# EAGLE design Capstone (EAGLE 9.5.2)
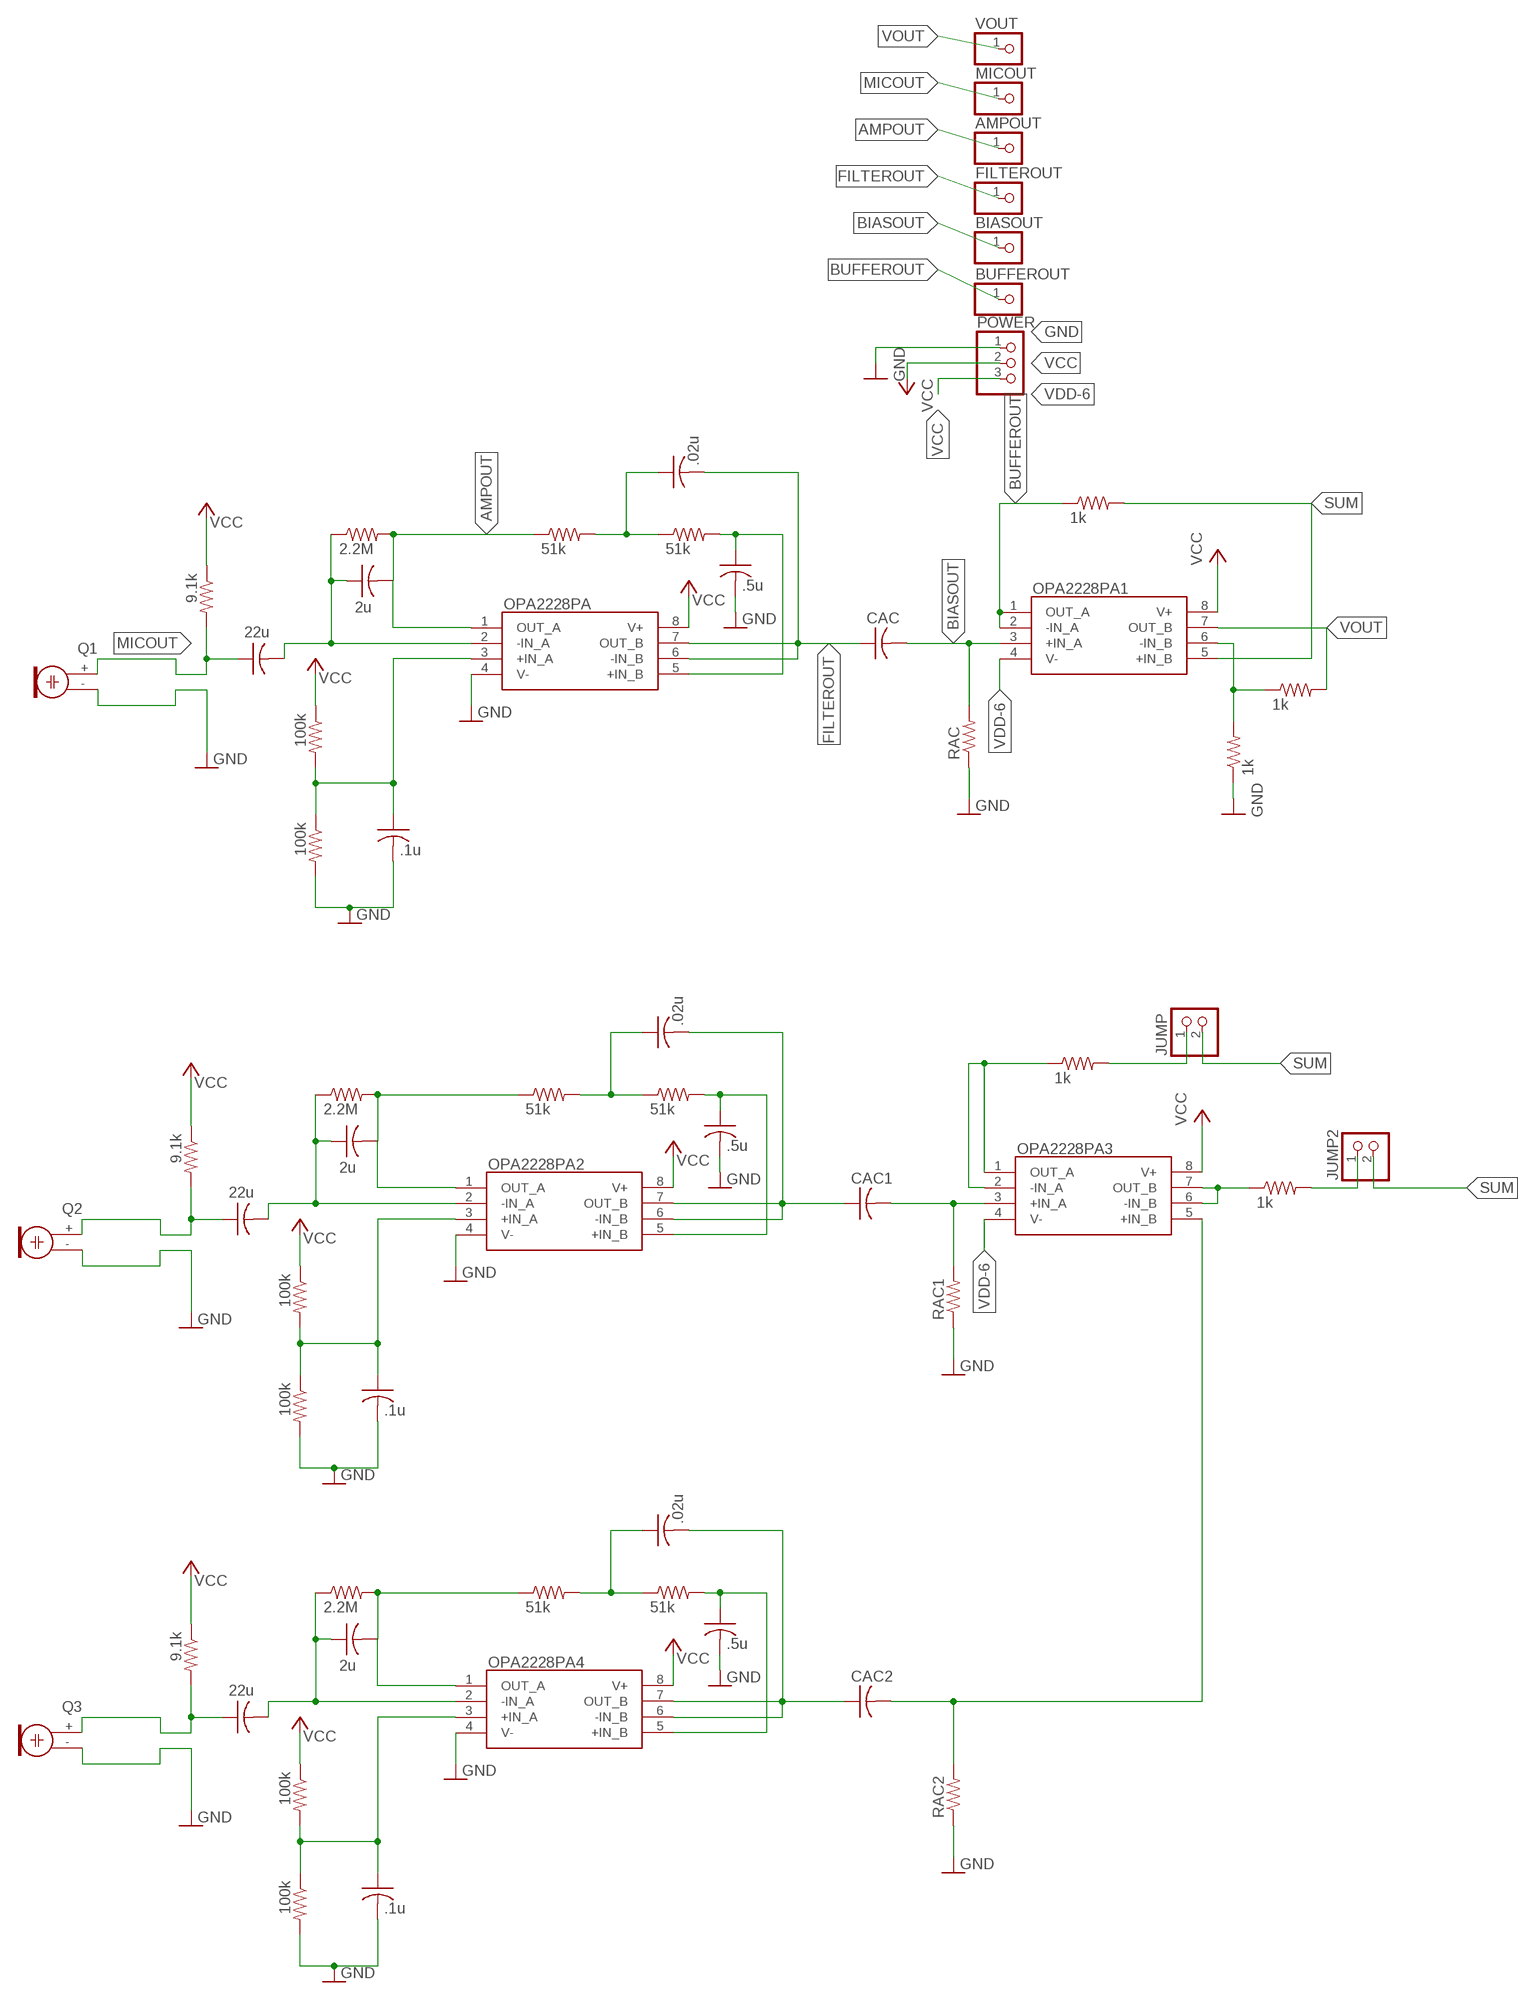
[diagram p0: schematic, sheet 1]

## Parts
AMPOUT  PINHD-1X1  [1X01]
BIASOUT  PINHD-1X1  [1X01]
BUFFEROUT  PINHD-1X1  [1X01]
C1  .1u  C-US025-024X044  [C025-024X044]
C2  2u  C-US025-024X044  [C025-024X044]
C3  22u  C-US025-024X044  [C025-024X044]
C4  .02u  C-US025-024X044  [C025-024X044]
C5  .5u  C-US025-024X044  [C025-024X044]
C6  .1u  C-US025-024X044  [C025-024X044]
C7  2u  C-US025-024X044  [C025-024X044]
C8  22u  C-US025-024X044  [C025-024X044]
C9  .02u  C-US025-024X044  [C025-024X044]
C10  .5u  C-US025-024X044  [C025-024X044]
C11  .1u  C-US025-024X044  [C025-024X044]
C12  2u  C-US025-024X044  [C025-024X044]
C13  22u  C-US025-024X044  [C025-024X044]
C14  .02u  C-US025-024X044  [C025-024X044]
C15  .5u  C-US025-024X044  [C025-024X044]
CAC  C-US025-024X044  [C025-024X044]
CAC1  C-US025-024X044  [C025-024X044]
CAC2  C-US025-024X044  [C025-024X044]
FILTEROUT  PINHD-1X1  [1X01]
JUMP  PINHD-1X2  [1X02]
JUMP2  PINHD-1X2  [1X02]
MICOUT  PINHD-1X1  [1X01]
OPA2228PA  OPA2228PA  [DIP794W53P254L959H508Q8N]
OPA2228PA1  OPA2228PA  [DIP794W53P254L959H508Q8N]
OPA2228PA2  OPA2228PA  [DIP794W53P254L959H508Q8N]
OPA2228PA3  OPA2228PA  [DIP794W53P254L959H508Q8N]
OPA2228PA4  OPA2228PA  [DIP794W53P254L959H508Q8N]
POWER  PINHD-1X3  [1X03]
Q1  ELECTRET  [9.7ELECTRET]
Q2  ELECTRET  [9.7ELECTRET]
Q3  ELECTRET  [9.7ELECTRET]
R1  9.1k  R-US_0204/7  [0204/7]
R2  100k  R-US_0204/7  [0204/7]
R3  100k  R-US_0204/7  [0204/7]
R4  2.2M  R-US_0204/7  [0204/7]
R5  51k  R-US_0204/7  [0204/7]
R6  51k  R-US_0204/7  [0204/7]
R7  1k  R-US_0204/7  [0204/7]
R8  1k  R-US_0204/7  [0204/7]
R9  1k  R-US_0204/7  [0204/7]
R10  9.1k  R-US_0204/7  [0204/7]
R11  100k  R-US_0204/7  [0204/7]
R12  100k  R-US_0204/7  [0204/7]
R13  2.2M  R-US_0204/7  [0204/7]
R14  51k  R-US_0204/7  [0204/7]
R15  51k  R-US_0204/7  [0204/7]
R16  1k  R-US_0204/7  [0204/7]
R17  9.1k  R-US_0204/7  [0204/7]
R18  100k  R-US_0204/7  [0204/7]
R19  100k  R-US_0204/7  [0204/7]
R20  2.2M  R-US_0204/7  [0204/7]
R21  51k  R-US_0204/7  [0204/7]
R22  51k  R-US_0204/7  [0204/7]
R23  1k  R-US_0204/7  [0204/7]
RAC  R-US_0204/7  [0204/7]
RAC1  R-US_0204/7  [0204/7]
RAC2  R-US_0204/7  [0204/7]
VOUT  PINHD-1X1  [1X01]

## Nets
1: C8.1 Q2.+ R10.2
2: C13.1 Q3.+ R17.2
AMPOUT: AMPOUT.1 C2.2 OPA2228PA.1(OUT_A) R4.2 R5.1
AMPOUT1: C7.2 OPA2228PA2.1(OUT_A) R13.2 R14.1
AMPOUT2: C12.2 OPA2228PA4.1(OUT_A) R20.2 R21.1
BIASOUT: BIASOUT.1 CAC.2 OPA2228PA1.3(+IN_A) RAC.2
BIASOUT1: CAC1.2 OPA2228PA3.3(+IN_A) RAC1.2
BIASOUT2: CAC2.2 OPA2228PA3.5(+IN_B) RAC2.2
BUFFEROUT: BUFFEROUT.1 OPA2228PA1.1(OUT_A) OPA2228PA1.2(-IN_A) R8.1
FILTEROUT: C4.2 CAC.1 FILTEROUT.1 OPA2228PA.6(-IN_B) OPA2228PA.7(OUT_B)
FILTEROUT1: C9.2 CAC1.1 OPA2228PA2.6(-IN_B) OPA2228PA2.7(OUT_B)
FILTEROUT2: C14.2 CAC2.1 OPA2228PA4.6(-IN_B) OPA2228PA4.7(OUT_B)
GND: C1.2 C5.2 C6.2 C10.2 C11.2 C15.2 OPA2228PA2.4(V-) OPA2228PA4.4(V-) OPA2228PA.4(V-) POWER.1 Q1.- Q2.- Q3.- R3.2 R7.1 R12.2 R19.2 RAC1.1 RAC2.1 RAC.1
MICOUT: C3.1 MICOUT.1 Q1.+ R1.2
N$1: C6.1 OPA2228PA2.3(+IN_A) R11.2 R12.1
N$3: C2.1 C3.2 OPA2228PA.2(-IN_A) R4.1
N$4: OPA2228PA1.6(-IN_B) R7.2 R9.1
N$5: C1.1 OPA2228PA.3(+IN_A) R2.2 R3.1
N$6: C7.1 C8.2 OPA2228PA2.2(-IN_A) R13.1
N$8: C4.1 R5.2 R6.1
N$9: C5.1 OPA2228PA.5(+IN_B) R6.2
N$10: C9.1 R14.2 R15.1
N$12: JUMP.1 R16.2
N$13: C10.1 OPA2228PA2.5(+IN_B) R15.2
N$14: OPA2228PA3.1(OUT_A) OPA2228PA3.2(-IN_A) R16.1
N$15: C11.1 OPA2228PA4.3(+IN_A) R18.2 R19.1
N$16: C12.1 C13.2 OPA2228PA4.2(-IN_A) R20.1
N$17: C14.1 R21.2 R22.1
N$18: C15.1 OPA2228PA4.5(+IN_B) R22.2
N$19: OPA2228PA3.6(-IN_B) OPA2228PA3.7(OUT_B) R23.1
N$20: JUMP2.1 R23.2
SUM: JUMP2.2 JUMP.2 OPA2228PA1.5(+IN_B) R8.2
VCC: OPA2228PA1.8(V+) OPA2228PA2.8(V+) OPA2228PA3.8(V+) OPA2228PA4.8(V+) OPA2228PA.8(V+) POWER.2 R1.1 R2.1 R10.1 R11.1 R17.1 R18.1
VDD-6: OPA2228PA1.4(V-) OPA2228PA3.4(V-) POWER.3
VOUT: OPA2228PA1.7(OUT_B) R9.2 VOUT.1

## Library data of the parts
AMPOUT BIASOUT BUFFEROUT FILTEROUT MICOUT VOUT = pinhead:PINHD-1X1: PIN HEADER
C1-C15 CAC CAC1 CAC2 = rcl:C-US: CAPACITOR, American symbol; SPICEPREFIX: C
JUMP JUMP2 = pinhead:PINHD-1X2: PIN HEADER
OPA2228PA OPA2228PA1-OPA2228PA4 = SamacSys_Parts:OPA2228PA: Dual, wide bandwidth, high precision, low noise operational amplifiers Source: Datasheet <http://componentsearchengine.com/Datasheets/3/OPA2228PA.pdf>; DESCRIPTION: Dual, wide bandwidth, high precision, low noise operational amplifiers; HEIGHT: 5.08mm; MANUFACTURER_NAME: Texas Instruments; MANUFACTURER_PART_NUMBER: OPA2228PA; MOUSER_PART_NUMBER: 595-OPA2228PA; MOUSER_PRICE-STOCK: https://www.mouser.com/Search/Refine.aspx?Keyword=595-OPA2228PA
POWER = pinhead:PINHD-1X3: PIN HEADER
Q1-Q3 = adafruit:ELECTRET: Electret microphone Thru hole 2.54mm spacing with 9.7mm diameter
R1-R23 RAC RAC1 RAC2 = rcl:R-US_: RESISTOR, American symbol; SPICEPREFIX: R

## Board
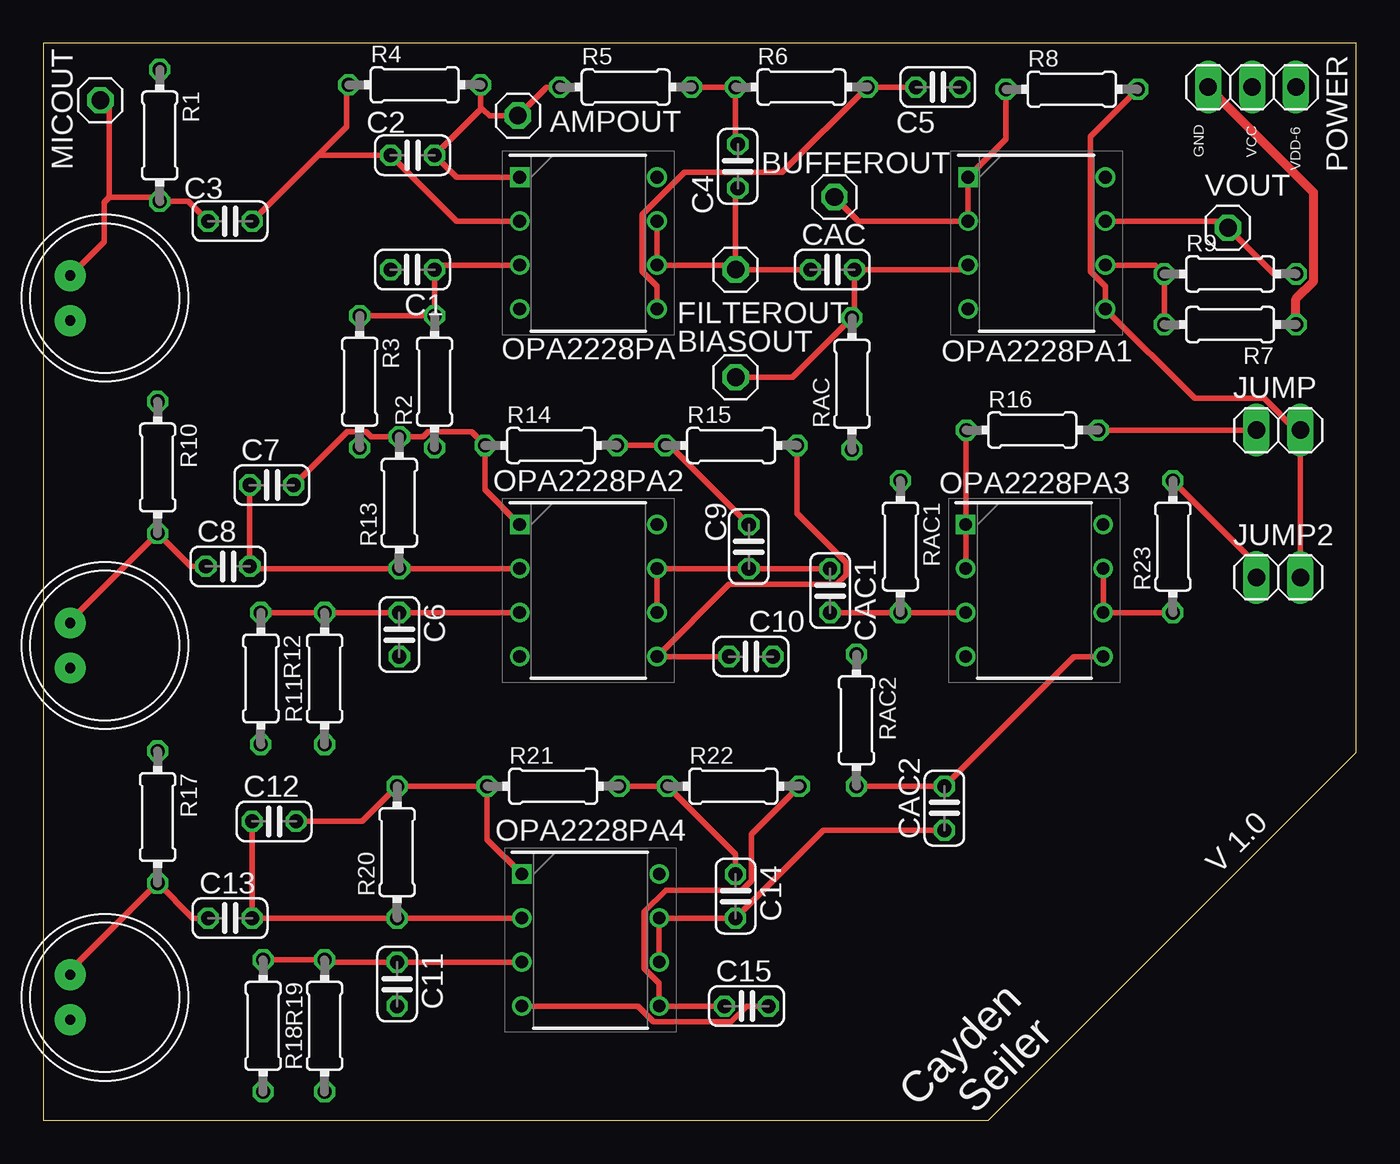
[diagram p1: board, top side]
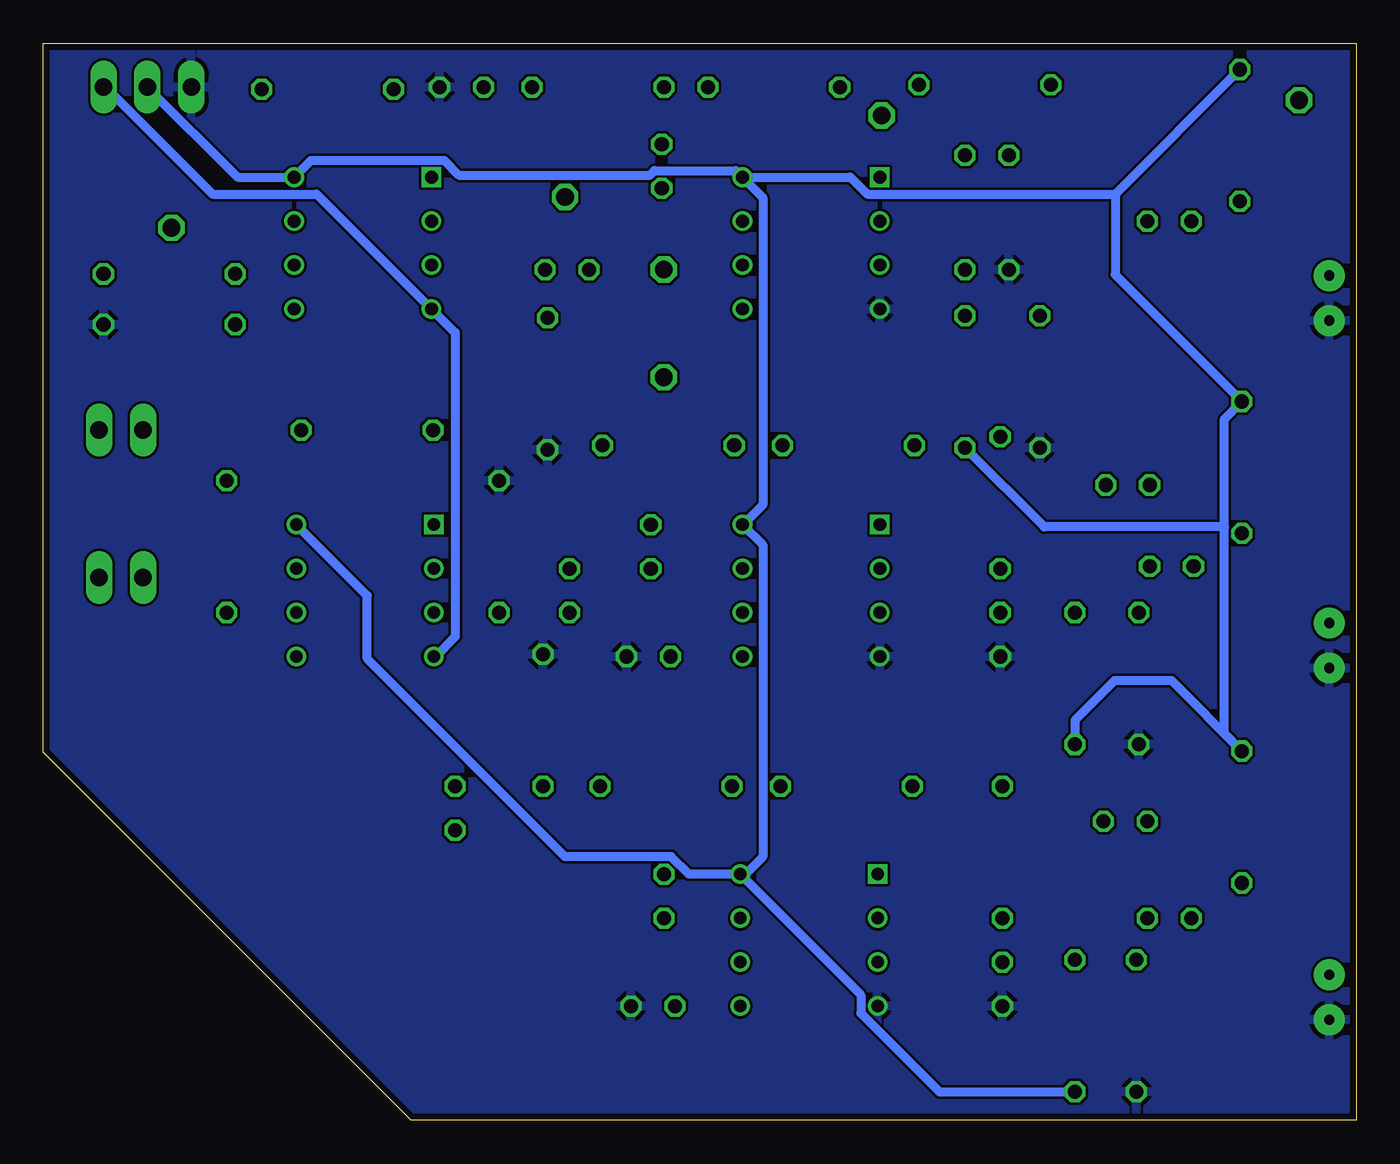
[diagram p2: board, bottom side, seen from below]

Size 75.87 x 62.22 mm. Coordinates in mm from the lower left corner, seen from the top.
Outline: 0,0 54.61,0 75.87,21.26 75.87,62.22 0,62.22 0,0
Copper layers (1*16): Top 0.035559375mm / dielectric 1.6mm / Bottom 0.035559375mm
Design rules "oshpark2layer": minimum track width 6mil, minimum drill 10mil, track to track 6mil, track to pad 6mil, pad to pad 6mil, via to via 6mil, smd to smd 6mil, copper to edge 15mil, drill to drill 6mil, minimum pad ring 5mil, minimum via ring 5mil, stop-mask expansion 2.5mil, vias tented up to drill 0mil, thermal gap 10mil

### Footprints (pad centres in the part's own frame; a part is rotated, then mirrored left to right if it is on the bottom)
1X01 = drill 1.016 octagon: 1 0,0
C025-024X044 = drill 0.813 octagon: 1 -1.27,0; 2 1.27,0
1X02 = drill 1.016 long: 1 -1.27,0; 2 1.27,0
DIP794W53P254L959H508Q8N = drill 0.73 pad 1.13 square: 1 -3.97,3.81 | drill 0.73 pad 1.13: 2 -3.97,1.27; 3 -3.97,-1.27; 4 -3.97,-3.81; 5 3.97,-3.81; 6 3.97,-1.27; 7 3.97,1.27; 8 3.97,3.81
1X03 = drill 1.016 long: 1 -2.54,0; 2 0,0; 3 2.54,0
9.7ELECTRET = drill 0.6 pad 1.778: + 1.3,2; - -1.3,2
0204/7 = drill 0.813 octagon: 1 -3.81,0; 2 3.81,0

### Placement (x,y rotation side)
AMPOUT  27.43,58.04 0 top
BIASOUT  40.01,42.93 0 top
BUFFEROUT  45.72,53.34 0 top
C1  21.34,49.15 180 top
C2  21.34,55.75 0 top
C3  10.79,51.94 0 top
C4  40.13,55.12 270 top
C5  51.69,59.69 0 top
C6  20.57,28.07 270 top
C7  13.21,36.7 0 top
C8  10.67,32 0 top
C9  40.77,33.15 270 top
C10  40.89,26.8 0 top
C11  20.45,7.87 270 top
C12  13.34,17.27 0 top
C13  10.79,11.68 0 top
C14  40.01,12.95 270 top
C15  40.64,6.6 0 top
CAC  45.59,49.15 0 top
CAC1  45.47,30.61 270 top
CAC2  52.07,18.03 90 top
FILTEROUT  40.01,49.15 0 top
JUMP  71.37,39.88 0 top
JUMP2  71.37,31.37 0 top
MICOUT  3.3,58.93 0 top
OPA2228PA  31.5,50.67 0 top
OPA2228PA1  57.4,50.67 0 top
OPA2228PA2  31.5,30.61 0 top
OPA2228PA3  57.28,30.61 0 top
OPA2228PA4  31.62,10.41 0 top
POWER  69.85,59.69 0 top
Q1  3.56,47.5 90 top
Q2  3.56,27.43 90 top
Q3  3.56,7.11 90 top
R1  6.73,56.9 270 top
R2  22.61,42.67 90 top
R3  18.29,42.67 270 top
R4  21.46,59.82 0 top
R5  33.66,59.69 0 top
R6  43.81,59.69 0 top
R7  68.58,45.97 180 top
R8  59.44,59.56 0 top
R9  68.58,48.89 0 top
R10  6.6,37.72 270 top
R11  16.26,25.53 90 top
R12  12.57,25.53 270 top
R13  20.57,35.69 90 top
R14  29.34,38.99 0 top
R15  39.75,38.99 0 top
R16  57.15,39.88 0 top
R17  6.6,17.53 270 top
R18  16.26,5.46 90 top
R19  12.7,5.46 270 top
R20  20.45,15.49 90 top
R21  29.46,19.3 0 top
R22  39.88,19.3 0 top
R23  65.28,33.15 90 top
RAC  46.74,42.55 90 top
RAC1  49.53,33.15 270 top
RAC2  46.99,23.11 270 top
VOUT  68.45,51.56 0 top

### Tracks (layer width: path | path; a pad name or v marks a point on that pad's centre or on a via)
1
  Top 0.305: C8.1 8.51,32 R10.2 1.56,28.86 Q2.+
2
  Top 0.305: C13.1 8.64,11.68 R17.2 1.56,8.67 Q3.+
AMPOUT
  Top 0.152: 25.27,58.42 25.4,58.42
  Top 0.305: OPA2228PA.1 23.88,54.48 C2.2 25.27,58.42 R4.2 | 25.4,58.42 25.78,58.04 AMPOUT.1 29.08,59.69 R5.1
AMPOUT1
  Top 0.305: C7.2 17.55,39.78 18.67,39.78 18.95,39.5 R13.2 21.95,39.5 22.23,39.78 24.74,39.78 R14.1 25.53,36.42 OPA2228PA2.1
AMPOUT2
  Top 0.305: OPA2228PA4.1 25.65,16.22 R21.1 R20.2 18.41,17.27 C12.2
BIASOUT
  Top 0.305: OPA2228PA1.3 53.18,49.15 CAC.2 46.86,46.48 RAC.2 43.31,42.93 BIASOUT.1
BIASOUT1
  Top 0.305: OPA2228PA3.3 RAC1.2 CAC1.2
BIASOUT2
  Top 0.305: OPA2228PA3.5 59.56,26.8 CAC2.2 RAC2.2
BUFFEROUT
  Top 0.305: BUFFEROUT.1 47.12,51.94 OPA2228PA1.2 OPA2228PA1.1 55.63,56.67 R8.1
FILTEROUT
  Top 0.305: OPA2228PA.7 OPA2228PA.6 39.75,49.4 FILTEROUT.1 | FILTEROUT.1 40.01,53.72 C4.2 | FILTEROUT.1 CAC.1
FILTEROUT1
  Top 0.305: OPA2228PA2.6 OPA2228PA2.7 C9.2 CAC1.1
FILTEROUT2
  Top 0.305: CAC2.1 45.09,16.76 C14.2 OPA2228PA4.7 OPA2228PA4.6
GND
  Top 0.305: C15.2 40.66,6.6 39.75,5.69 35.28,5.69 34.36,6.6 OPA2228PA4.4
  Top 0.508: R7.1 72.39,47.46 73.41,48.47 73.41,53.59 POWER.1
  pour Bottom: 76.2,62.23 0,62.23 0,0 54.61,0 76.2,21.59
MICOUT
  Top 0.152: 3.81,58.42 MICOUT.1
  Top 0.305: 3.81,53.34 3.81,58.42 | C3.1 8.38,53.09 R1.2 6.48,53.34 3.81,53.34 | 3.81,53.34 3.52,53.05 3.52,50.76 Q1.+
N$1
  Top 0.305: OPA2228PA2.3 C6.1 R11.2 R12.1
N$3
  Top 0.152: 17.65,59.69 R4.1
  Top 0.305: C3.2 15.88,55.75 | 15.88,55.75 17.53,57.4 17.53,59.56 17.65,59.69 | 15.88,55.75 C2.1 23.88,51.94 OPA2228PA.2
N$4
  Top 0.305: OPA2228PA1.6 64.26,49.4 R9.1 R7.2
N$5
  Top 0.305: OPA2228PA.3 22.86,49.4 C1.1 R2.2 R3.1
N$6
  Top 0.305: C7.1 C8.2 12.06,31.88 R13.1 OPA2228PA2.2
N$8
  Top 0.305: R5.2 R6.1 40.01,56.52 C4.1
N$9
  Top 0.305: C5.1 R6.2 42.7,54.76 37.05,54.76 34.6,52.3 34.6,49.04 35.47,48.17 OPA2228PA.5
N$10
  Top 0.305: R14.2 R15.1 36.2,38.99 C9.1
N$12
  Top 0.305: R16.2 JUMP.1
N$13
  Top 0.152: OPA2228PA2.5 35.56,26.8
  Top 0.305: C10.1 35.56,26.8 | OPA2228PA2.5 39.63,30.96 45.84,30.96 46.38,31.5 46.38,32.26 43.56,35.07 R15.2
N$14
  Top 0.305: OPA2228PA3.2 OPA2228PA3.1 53.31,39.84 R16.1
N$15
  Top 0.305: OPA2228PA4.3 C11.1 16.38,9.14 R18.2 R19.1
N$16
  Top 0.305: C12.1 C13.2 R20.1 OPA2228PA4.2
N$17
  Top 0.305: C14.1 40.01,15.37 R22.1 R21.2
N$18
  Top 0.305: R22.2 40.92,16.53 40.92,13.84 40.38,13.31 35.99,13.31 34.72,12.04 34.72,8.78 35.59,7.91 OPA2228PA4.5 C15.1
N$19
  Top 0.305: R23.1 OPA2228PA3.6 OPA2228PA3.7
N$20
  Top 0.305: JUMP2.1 70.1,32.13 R23.2
SUM
  Top 0.305: R8.2 60.5,56.82 60.5,49.04 61.37,48.17 OPA2228PA1.5 66.53,41.71 70.55,41.71 72.38,39.88 JUMP.2 JUMP2.2
VCC
  Bottom 0.508: OPA2228PA.8 29.23,54.48 28.26,53.51 13.93,53.51 | R1.1 13.93,53.51 | POWER.2 64.64,54.48 OPA2228PA1.8 60.4,55.45 52.7,55.45 51.86,54.61 40.81,54.61 40.55,54.86 35.85,54.86 OPA2228PA.8 | OPA2228PA.8 34.29,53.31 34.29,35.56 35.43,34.42 OPA2228PA2.8 34.29,33.24 34.29,15.24 35.31,14.22 OPA2228PA4.8 | OPA2228PA4.8 38.57,14.22 39.58,15.24 45.72,15.24 57.15,26.67 57.15,30.32 OPA2228PA3.8 | 13.93,53.51 13.93,48.85 R10.1 7.62,40.51 7.62,34.29 | 7.62,34.29 7.62,22.35 R17.1 10.67,25.4 13.97,25.4 16.26,23.11 R11.1 | OPA2228PA4.8 28.62,7.25 28.62,6.2 24.07,1.65 R18.1 | 7.62,34.29 18.03,34.29 R2.1
VDD-6
  Bottom 0.508: POWER.3 72.26,59.69 66.09,53.51 60.08,53.51 OPA2228PA1.4 52.07,45.5 52.07,27.94 53.21,26.8 OPA2228PA3.4
VOUT
  Top 0.305: R9.2 71.12,48.89 VOUT.1 68.07,51.94 OPA2228PA1.7

### Text on the board
tNames: GND | VCC | VDD-6 | V 1.0 | Cayden / Seiler
tStop: C:/Users/cayde/Pictures/M_Logo_Final256.bmp